# Altium schematic sheet clk40.SchDoc: FPGA Clock
size A; Engineer: A. Peck; Organization: UCLA High Energy Physics; DocumentNumber: 9; Revision: 3.0; SheetNumber: 9; SheetTotal: 15; Project: LCT Comparator Tester
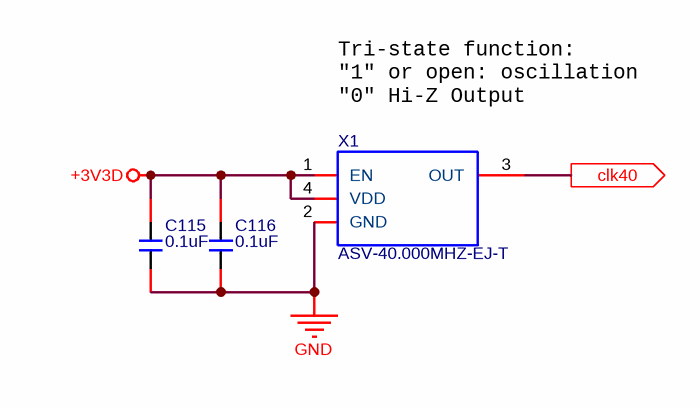
[diagram p0: clk40.SchDoc]

## Parts
C115  0.1uF  [C0603]
C116  0.1uF  [C0603]
X1  ASV-40.000MHZ-EJ-T  [XTAL-SMD]

## Ports
clk40 (out)

## Nets
+3V3D: C115.1 C116.1 X1.1(EN) X1.4(VDD)
GND: C115.2 C116.2 X1.2(GND)
clk40: X1.3(OUT) ; port clk40

## Notes on the sheet
- (near X1) Tri-state function:
  "1" or open: oscillation
  "0" Hi-Z Output
- Date:
- Rev:
- of
- Sheet

## Library data of the parts
C115 C116 = CAP/06035C104KAT2A: CAP-CER, 2, 0.1uF, 10%, 50V, 0603, X7R; Manufacturer: AVX Corporation; Capacitance: 0.10µF; Supplier 1: Digi-Key; Manufacturer Part Number: 06035C104KAT2A; RoHS: RoHS Compliant; Category: Capacitors; Stock 1: 4412408; Pricing 1: 1=0.1, 10=0.036, 25=0.0264, 50=0.0198, 100=0.0162, 250=0.01352, 500=0.01156, 1000=0.00908 (USD); Packaging: Cut Tape (CT); Tolerance: ±10%; Voltage - Rated: 50V; Temperature Coefficient: X7R; Mounting Type: Surface Mount, MLCC; Operating Temperature: -55°C ~ 125°C; Applications: General Purpose; Ratings: -; Package / Case: 0603 (1608 Metric); Size / Dimension: 0.063" L x 0.032" W (1.60mm x 0.81mm); Height - Seated (Max): -; Thickness (Max): 0.035" (0.90mm); Lead Spacing: -; Features: -; Lead Style: -; ComponentLink1URL: http://datasheets.avx.com/X7RDielectric.pdf; ComponentLink1Description: http://datasheets.avx.com/X7RDielectric.pdf; Supplier Part Number 1: 478-5052-1-ND; Supplier 2: Newark; Supplier Part Number 2: 54K2412
X1 = ASV-40.000MHZ-EJ-T: XTAL, 40MHz, CMOS; Manufacturer: Abracon LLC; Function: Enable/Disable; Output: HCMOS; Voltage - Supply: 3.3V; Frequency Stability: ±20ppm; Current - Supply (Max): 25mA; Current - Supply (Disable) (Max): 10µA; Supplier 1: Digi-Key; Manufacturer Part Number: ASV-40.000MHZ-EJ-T; RoHS: RoHS Compliant; Category: Crystals and Oscillators; Stock 1: 8558; Pricing 1: 1=1.34, 10=1.186, 50=1.1074, 100=0.98, 500=0.9261 (USD); Packaging: Cut Tape (CT); Part Status: Active; Type: XO (Standard); Frequency: 40MHz; Operating Temperature: -20°C ~ 70°C; Ratings: -; Mounting Type: Surface Mount; Size / Dimension: 0.276" L x 0.200" W (7.00mm x 5.08mm); Height: 0.071" (1.80mm); Package / Case: 4-SMD, No Lead (DFN, LCC); ComponentLink1URL: http://www.abracon.com/Oscillators/ASV.pdf; ComponentLink1Description: http://www.abracon.com/Oscillators/ASV.pdf; Supplier Part Number 1: 535-9327-1-ND